# EAGLE design DMX-Injektor (EAGLE 5.11)
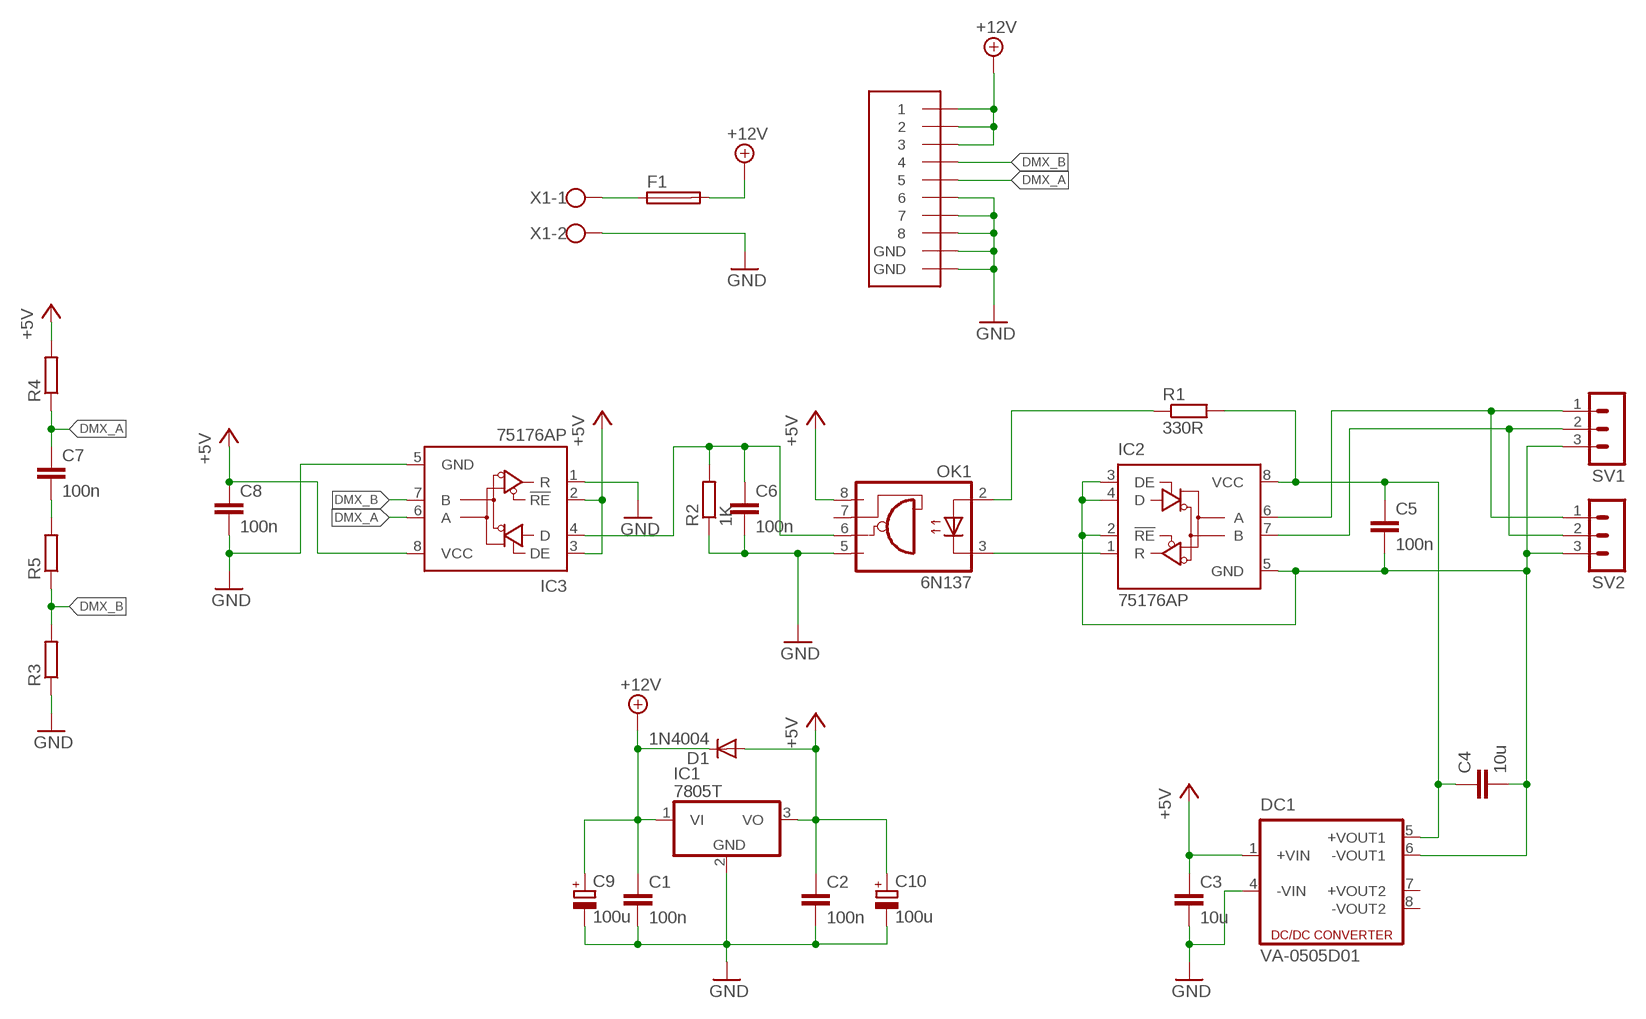
[diagram p0: schematic, sheet 1]

## Parts
C1  100n  C-EU025-050X050  [C025-050X050]
C2  100n  C-EU025-050X050  [C025-050X050]
C3  10u  C-EU025-050X050  [C025-050X050]
C4  10u  C-EU025-050X050  [C025-050X050]
C5  100n  C-EU025-050X050  [C025-050X050]
C6  100n  C-EU025-050X050  [C025-050X050]
C7  100n  C-EU025-050X050  [C025-050X050]
C8  100n  C-EU025-050X050  [C025-050X050]
C9  100u  CPOL-EUE2.5-7  [E2,5-7]
C10  100u  CPOL-EUE2.5-7  [E2,5-7]
D1  1N4004  [DO41-10]
DC1  VA-0505D01  [8DIL-6]
F1  GSH15  [GSH15]
IC1  7805T  [TO220H]
IC2  75176AP  [DIL08]
IC3  75176AP  [DIL08]
OK1  6N137  [DIL08]
R1  330R  R-EU_0207/10  [0207/10]
R2  1K  R-EU_0207/10  [0207/10]
R3  R-EU_0207/10  [0207/10]
R4  R-EU_0207/10  [0207/10]
R5  R-EU_0207/10  [0207/10]
SV1  MA03-1  [MA03-1]
SV2  MA03-1  [MA03-1]
U$1  MEBP8-8G  [RJ45-REICHELT]
X1  W237-102  [W237-102]

## Nets
+5V: C2.1 C3.1 C8.1 C10.+ D1.A DC1.1(+VIN) IC1.3(VO) IC3.2(!RE) IC3.3(DE) IC3.8(VCC) OK1.8(VCC) R4.2
+12V: C1.1 C9.+ D1.C F1.2 IC1.1(VI) U$1.1 U$1.2 U$1.3
DMX_A: C7.1 IC3.6(A) R4.1 U$1.5
DMX_B: IC3.7(B) R3.2 R5.1 U$1.4
GND: C1.2 C2.2 C3.2 C6.2 C8.2 C9.- C10.- DC1.4(-VIN) IC1.2(GND) IC3.1(R) IC3.5(GND) OK1.5(GND) R2.1 R3.1 U$1.6 U$1.7 U$1.8 U$1.GND@1(GND) U$1.GND@2(GND) X1.2
N$1: F1.1 X1.1
N$2: C4.2 C5.2 DC1.6(-VOUT1) IC2.2(!RE) IC2.3(DE) IC2.4(D) IC2.5(GND) SV1.3 SV2.3
N$3: C6.1 IC3.4(D) OK1.6(VO) R2.2
N$4: IC2.1(R) OK1.3(C)
N$5: C4.1 C5.1 DC1.5(+VOUT1) IC2.8(VCC) R1.2
N$6: IC2.6(A) SV1.1 SV2.1
N$7: IC2.7(B) SV1.2 SV2.2
N$8: OK1.2(A) R1.1
N$12: C7.2 R5.2
Unconnected: DC1.7(+VOUT2) DC1.8(-VOUT2) OK1.7(VE)

## Library data of the parts
C1-C8 = rcl:C-EU: CAPACITOR, European symbol
C9 C10 = rcl:CPOL-EU: POLARIZED CAPACITOR, European symbol
D1 = diode:1N4004: DIODE general purpose rectifier, 1 A
DC1 = dc-dc-converter:VA-*D01: DC DC Converter Dual Separate Output, 1 Watt Motien Technology Co.,Ltd. Source: VA-D01.pdf; OC_FARNELL: unknown; OC_NEWARK: unknown
F1 = fuse:GSH15: FUSE HOLDER grid 15mm, 19649 Wickmann; MPN: 64900001039; OC_FARNELL: 1271673; OC_NEWARK: 02P0318
IC1 = linear:78*: Positive VOLTAGE REGULATOR Source: http://cache.national.com/ds/LM/LM78L05.pdf http://www.fairchildsemi.com/ds/LM/LM7805.pdf
IC2 IC3 = 751xx:75176A: DIFFERENTIAL BUS TRANSCEIVER Source: http://focus.ti.com/lit/ds/symlink/sn75176a.pdf
OK1 = optocoupler:6N137: MOTOROLA OPTO COUPLER; MPN: 6N137; OC_FARNELL: 1328376; OC_NEWARK: 52M1895
R1-R5 = rcl:R-EU_: RESISTOR, European symbol
SV1 SV2 = con-lstb:MA03-1: PIN HEADER; OC_FARNELL: unknown; OC_NEWARK: unknown
U$1 = Reichelt:MEBP8-8G
X1 = con-wago-500:W237-102: WAGO SCREW CLAMP; MPN: 237-102; OC_FARNELL: unknown; OC_NEWARK: 70K9898

## Board
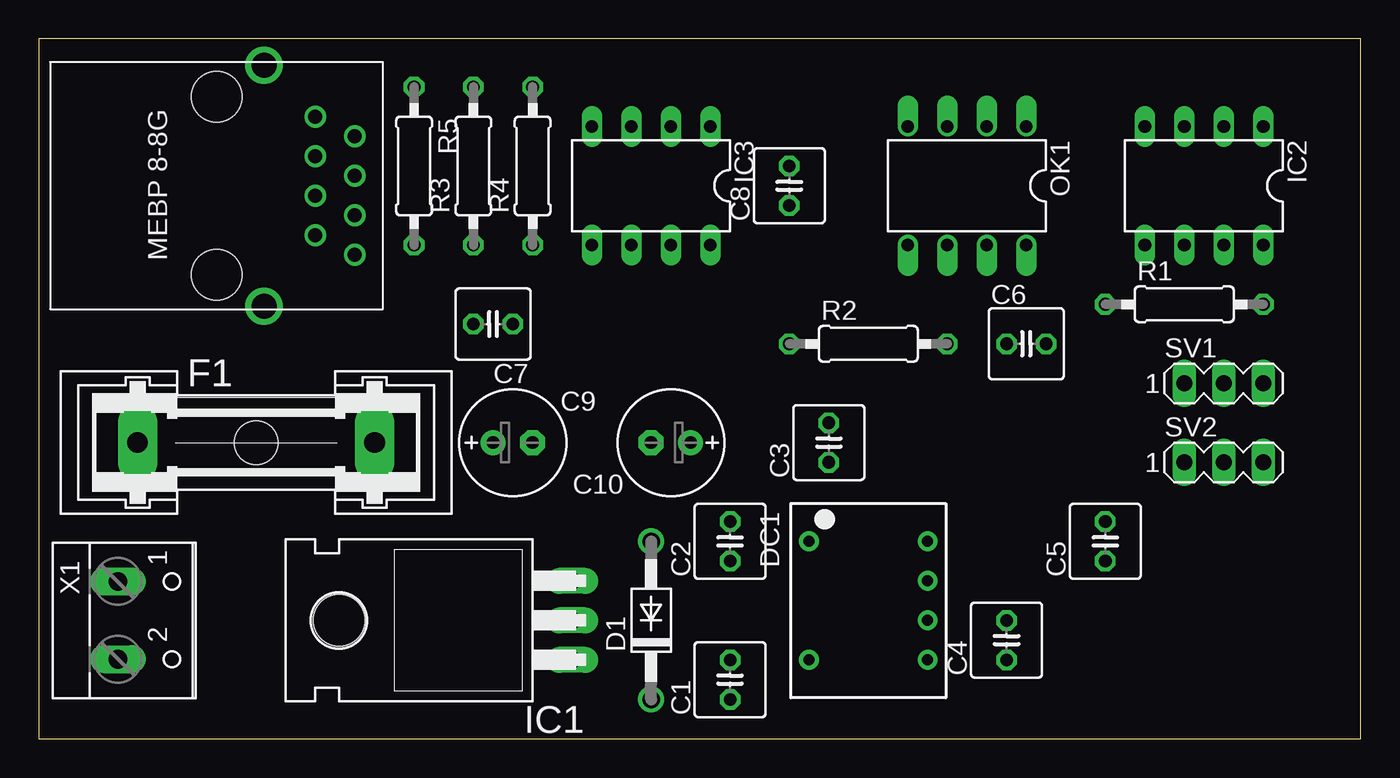
[diagram p1: board, top side]
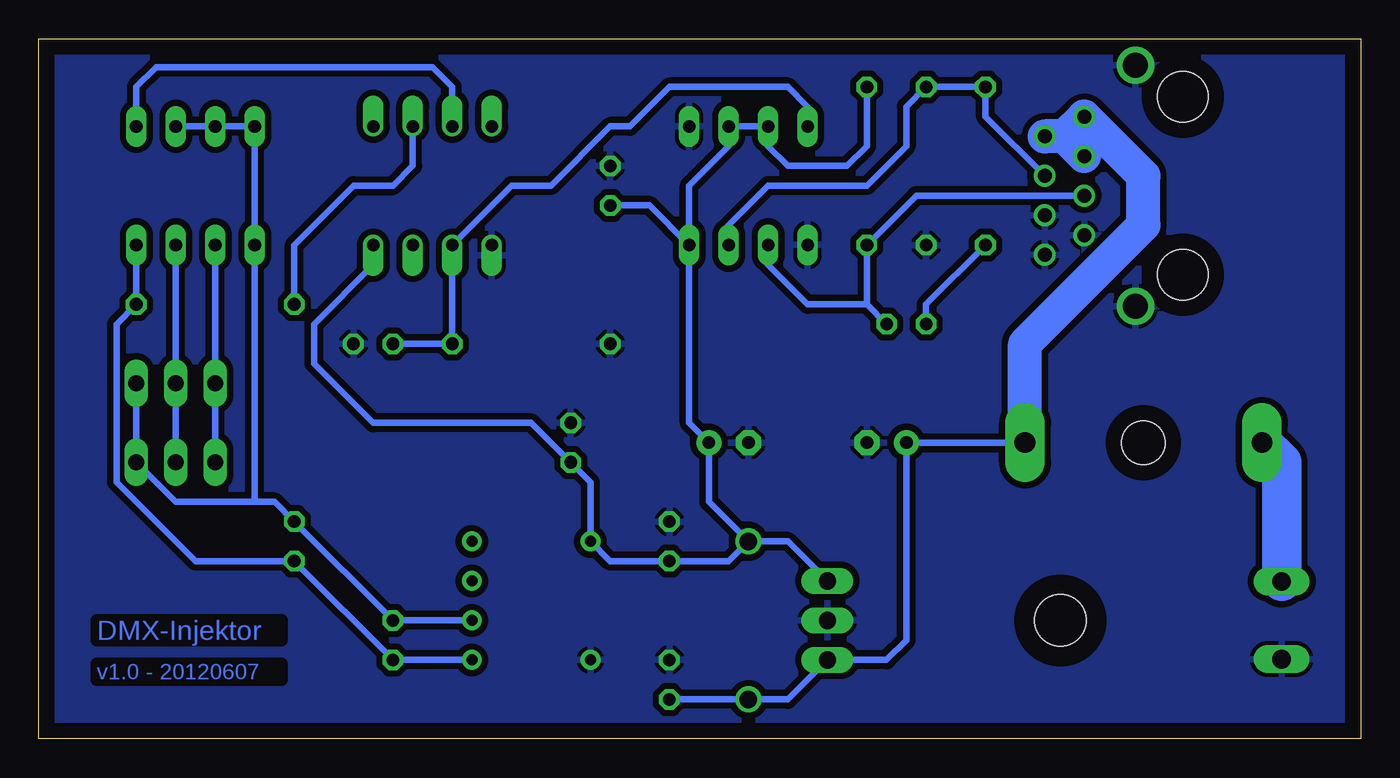
[diagram p2: board, bottom side, seen from below]

Size 85 x 45 mm. Coordinates in mm from the lower left corner, seen from the top.
Outline: 0,0 85,0 85,45 0,45 0,0
Copper layers (1*16): Top 0.035mm / dielectric 1.5mm / Bottom 0.035mm
Design rules "default": minimum track width 10mil, minimum drill 24mil, track to track 8mil, track to pad 8mil, pad to pad 8mil, via to via 8mil, smd to smd 8mil, copper to edge 40mil, drill to drill 8mil, minimum pad ring 10mil, minimum via ring 8mil, stop-mask expansion 4mil, vias tented up to drill 0mil, thermal gap 10mil

### Footprints (pad centres in the part's own frame; a part is rotated, then mirrored left to right if it is on the bottom)
C025-050X050 = drill 0.813 octagon: 1 -1.27,0; 2 1.27,0
E2,5-7 = drill 0.813 pad 1.6 round: + -1.27,0 | drill 0.813 pad 1.6 octagon: - 1.27,0
DO41-10 = drill 1.118 round: A 5.08,0; C -5.08,0
8DIL-6 = drill 0.7 pad 1.27 round: 1 -3.81,-3.81; 4 3.81,-3.81; 5 3.81,3.81; 6 1.27,3.81; 7 -1.27,3.81; 8 -3.81,3.81
GSH15 = drill 1.321 pad 2.54 long: 1 -7.62,0; 2 7.62,0 | hole 2.794: 0,0
TO220H = drill 1.118 long: 1 -2.54,-10.16; 2 0,-10.16; 3 2.54,-10.16 | hole 3.302: 0,4.826
DIL08 = drill 0.813 long: 1 -3.81,-3.81; 2 -1.27,-3.81; 3 1.27,-3.81; 4 3.81,-3.81; 5 3.81,3.81; 6 1.27,3.81; 7 -1.27,3.81; 8 -3.81,3.81
DIL08' = drill 0.813 offset: 1 -3.81,-3.81; 2 -1.27,-3.81; 3 1.27,-3.81; 4 3.81,-3.81; 5 3.81,3.81; 6 1.27,3.81; 7 -1.27,3.81; 8 -3.81,3.81
0207/10 = drill 0.813 octagon: 1 -5.08,0; 2 5.08,0
MA03-1 = drill 1.016 long: 1 -2.54,0; 2 0,0; 3 2.54,0
RJ45-REICHELT = drill 0.9 round: 1 -4.445,6.35; 2 -3.175,8.89; 3 -1.905,6.35; 4 -0.635,8.89; 5 0.635,6.35; 6 1.905,8.89; 7 3.175,6.35; 8 4.445,8.89 | drill 1.6 round: GND@1 -7.745,3.05; GND@2 7.745,3.05 | hole 3.25: -5.715,0; 5.715,0
W237-102 = drill 1.194 long: 1 -2.5,-1.27; 2 2.5,-1.27

### Placement (x,y rotation side)
C1  44.45,3.81 90 top
C2  44.45,12.7 90 top
C3  50.8,19.05 90 top
C4  62.23,6.35 90 top
C5  68.58,12.7 90 top
C6  63.5,25.4 0 top
C7  29.21,26.67 180 top
C8  48.26,35.56 90 top
C9  30.48,19.05 0 top
C10  40.64,19.05 180 top
D1  39.37,7.62 90 top
DC1  53.34,8.89 270 top
F1  13.97,19.05 0 top
IC1  24.13,7.62 90 top
IC2  74.93,35.56 180 top
IC3  39.37,35.56 180 top
OK1  6N137  [DIL08']  59.69,35.56 180 top
R1  73.66,27.94 0 top
R2  53.34,25.4 0 top
R3  27.94,36.83 90 top
R4  31.75,36.83 90 top
R5  24.13,36.83 270 top
SV1  76.2,22.86 0 top
SV2  76.2,17.78 0 top
U$1  11.43,35.56 270 top
X1  6.35,7.62 270 top

### Tracks (layer width: path | path; a pad name or v marks a point on that pad's centre or on a via)
+5V
  Bottom 0.406: IC3.8 43.18,35.56 40.64,38.1 IC3.2 IC3.3 38.1,38.1 36.83,36.83 33.02,36.83 31.75,38.1 R4.2 | D1.A 36.83,12.7 IC1.3 | D1.A 41.91,15.24 C10.+ 43.18,20.32 IC3.8 | D1.A 40.64,11.43 C2.1 48.26,11.43 DC1.1 49.53,16.51 C3.1 53.34,20.32 63.5,20.32 67.31,24.13 67.31,26.67 63.5,30.48 OK1.8 | C8.1 45.72,34.29 IC3.8
+12V
  Bottom 0.406: F1.2 C9.+ 29.21,6.35 30.48,5.08 IC1.1 36.83,2.54 D1.C C1.1
  Bottom 2.184: F1.2 21.59,25.4 13.97,33.02 13.97,36.2 U$1.1 19.05,38.73 | 19.05,38.73 U$1.3 | 19.05,38.73 U$1.2
DMX_A
  Bottom 0.406: 31.75,27.94 C7.1 | 31.75,27.94 R4.1 28.57,34.92 U$1.5 | IC3.6 38.1,30.48 35.56,27.94 31.75,27.94
DMX_B
  Bottom 0.406: U$1.4 24.13,40.01 R5.1 R3.2 29.21,40.64 29.21,38.1 31.75,35.56 38.1,35.56 40.64,33.02 IC3.7
GND
  pour Bottom (isolate 0.406): 0,45 0,0 85,0 85,45
N$1
  Bottom 2.54: X1.1 5.08,17.78 F1.1
N$2
  Bottom 0.406: IC2.2 IC2.3 IC2.4 IC2.5 71.12,15.24 | DC1.6 C4.2 C5.2 69.85,15.24 71.12,15.24 | 71.12,15.24 76.2,15.24 SV2.3 SV1.3
N$3
  Bottom 0.406: C6.1 R2.2 OK1.6 54.61,35.56 52.07,35.56 48.26,39.37 46.99,39.37 44.45,41.91 36.83,41.91 35.56,40.64 IC3.4
N$4
  Bottom 0.406: OK1.3 58.42,41.91 59.69,43.18 77.47,43.18 78.74,41.91 IC2.1
N$5
  Bottom 0.406: DC1.5 C4.1 C5.1 74.93,11.43 80.01,16.51 80.01,26.67 R1.2 IC2.8
N$6
  Bottom 0.406: SV2.1 SV1.1 IC2.6
N$7
  Bottom 0.406: SV2.2 SV1.2 IC2.7
N$8
  Bottom 0.406: R1.1 68.58,31.75 64.77,35.56 62.23,35.56 60.96,36.83 OK1.2
N$12
  Bottom 0.406: R5.2 27.94,27.94 C7.2

### Text on the board
Bottom: DMX-Injektor | v1.0 - 20120607